# Altium schematic sheet motordriver-v4.0_stspin.SchDoc
size A4; SheetNumber: 3; SheetTotal: 3
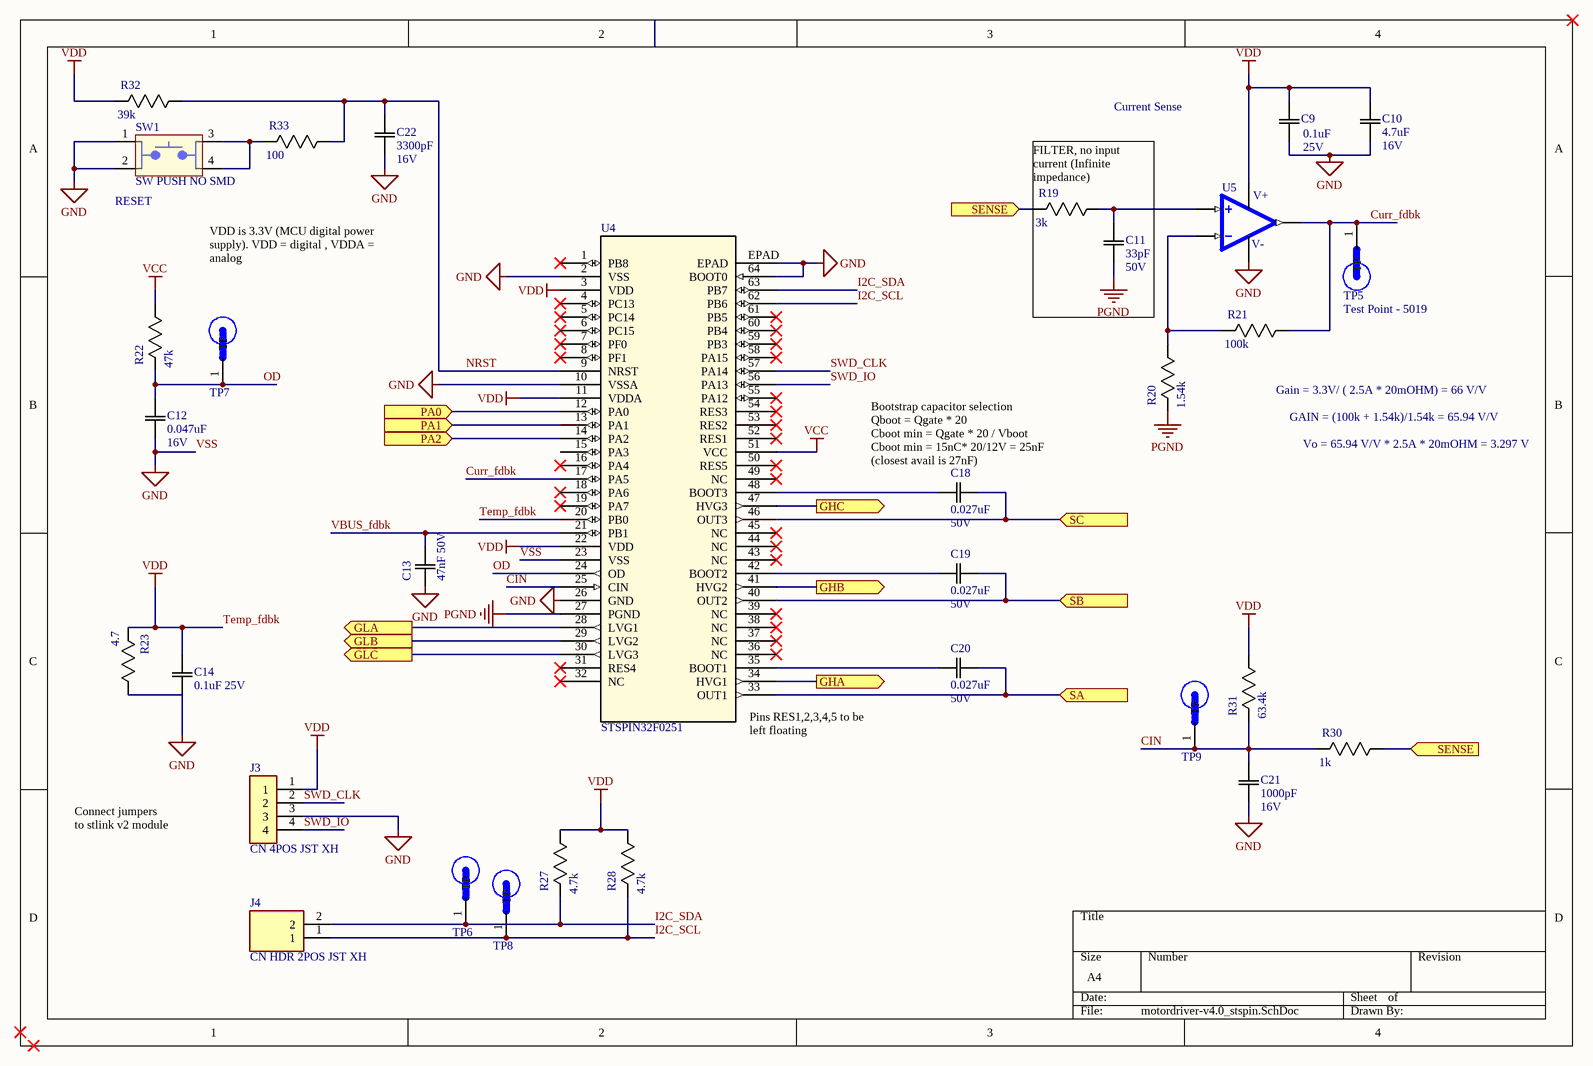
[diagram p0: motordriver-v4.0_stspin.SchDoc]

## Parts
C9  value 0.1uF  Rating: 25V  [0805]  (hidden comment: 0.1uF 25V)
C10  Rating: 16V  [0603]  (hidden comment: 4.7uF)
C11  Rating: 50V  [0603]  (hidden comment: 33pF)
C12  Rating: 16V  [0603]  (hidden comment: 0.047uF)
C13  47nF 50V  [0805]
C14  0.1uF 25V  [0805]
C18  0.027uF  Rating: 50V  [0805]
C19  0.027uF  Rating: 50V  [0805]
C20  0.027uF  Rating: 50V  [0805]
C21  Rating: 16V  [0603]  (hidden comment: 1000pF)
C22  Rating: 16V  [0603]  (hidden comment: 3300pF)
J3  CN 4POS JST XH  [JST_B4B-XH-A(LF)(SN)]
J4  CN HDR 2POS JST XH  [JST_B2B-XH-A(LF)(SN)]
R19  3k  [0603]
R20  1.54k  [0603]
R21  100k  [0603]
R22  47k  [0603]
R23  4.7  [0603]
R27  4.7k  [0603]
R28  4.7k  [0603]
R30  1k  [0603]
R31  63.4k  [0603]
R32  39k  [0603]
R33  100  [0603]
SW1  SW PUSH NO SMD  [TL3305]
TP5  Test Point - 5019  [TP380X203]
TP6  Test Point - 5019  [TP380X203]  (value not drawn)
TP7  Test Point - 5019  [TP380X203]  (value not drawn)
TP8  Test Point - 5019  [TP380X203]  (value not drawn)
TP9  Test Point - 5019  [TP380X203]  (value not drawn)
U4  STSPIN32F0251  [STSPIN32F0251TR]
U5  OP AMP TSV911ILT  [TSV911ILT Opamp]  (value not drawn)

## Ports
GHA (out), GHB (out), GHC (out), GLA (out), GLB (out), GLC (out), PA0 (in), PA1 (in), PA2 (in), SA (in), SB (in), SC (in), SENSE (in)

## Nets
PGND: C11.1(C1) R20.2(R2) U4.27(PGND)
Temp_fdbk: C9.2(C2) C10.2(C2) C14.2(C2) J3.1 R23.2(R2) R27.1(R1) R28.1(R1) R31.1(R1) R32.2(R2) U4.3(VDD) U4.11(VDDA) U4.20(PB0) U4.22(VDD) U5.5(V+)  [also labelled VDD]
VCC: R22.1(R1) U4.51(VCC)
VSS: C9.1(C1) C10.1(C1) C12.1(C1) C13.1(C1) C14.1(C1) C21.2(C2) C22.1(C1) J3.3 R23.1(R1) SW1.1 SW1.2 U4.2(VSS) U4.10(VSSA) U4.23(VSS) U4.26(GND) U4.64(BOOT0) U4.EPAD U5.2(V-)  [also labelled GND]
CIN: C21.1(C1) R30.2(R2) R31.2(R2) TP9.1(TP) U4.25(CIN)
Curr_fdbk: R21.1(R1) TP5.1(TP) U4.17(PA5) U5.1(OUT)
GHA: U4.34(HVG1) ; port GHA
GHB: U4.41(HVG2) ; port GHB
GHC: U4.47(HVG3) ; port GHC
GLA: U4.28(LVG1) ; port GLA
GLB: U4.29(LVG2) ; port GLB
GLC: U4.30(LVG3) ; port GLC
I2C_SCL: J4.1 R28.2(R2) TP8.1(TP) U4.62(PB6)
I2C_SDA: J4.2 R27.2(R2) TP6.1(TP) U4.63(PB7)
NRST: C22.2(C2) R32.1(R1) R33.1(R1) U4.9(NRST)
OD: C12.2(C2) R22.2(R2) TP7.1(TP) U4.24(OD)
PA0: U4.12(PA0) ; port PA0
PA1: U4.13(PA1) ; port PA1
PA2: U4.14(PA2) ; port PA2
SA: C20.2 U4.33(OUT1) ; port SA
SB: C19.2 U4.40(OUT2) ; port SB
SC: C18.2 U4.46(OUT3) ; port SC
SENSE: R19.2(R2) R30.1(R1) ; port SENSE
SWD_CLK: J3.2 U4.57(PA14)
SWD_IO: J3.4 U4.56(PA13)
VBUS_fdbk: C13.2(C2) U4.21(PB1)
NetC11_2: C11.2(C2) R19.1(R1) U5.3(IN+)
NetC18_1: C18.1 U4.48(BOOT3)
NetC19_1: C19.1 U4.42(BOOT2)
NetC20_1: C20.1 U4.35(BOOT1)
NetR20_1: R20.1(R1) R21.2(R2) U5.4(IN-)
NetR33_2: R33.2(R2) SW1.3 SW1.4

Not connected (* = marked no-connect by the designer): U4 1(PB8)* 4(PC13)* 5(PC14)* 6(PC15)* 7(PF0)* 8(PF1)* 15(PA3) 16(PA4)* 18(PA6)* 19(PA7)* 31(RES4)* 32(NC)* 36(NC)* 37(NC)* 38(NC)* 39(NC)* 43(NC)* 44(NC)* 45(NC)* 49(NC)* 50(RES5)* 52(RES1)* 53(RES2)* 54(RES3)* 55(PA12)* 58(PA15)* 59(PB3)* 60(PB4)* 61(PB5)*

## Notes on the sheet
- Current Sense
- (near SW1) RESET
- VDD is 3.3V (MCU digital power supply). VDD = digital , VDDA = analog
- FILTER, no input current (Infinite impedance)
- Gain = 3.3V/ ( 2.5A * 20mOHM) = 66 V/V
- (near C18) Bootstrap capacitor selection
  Qboot = Qgate * 20
  Cboot min = Qgate * 20 / Vboot
  Cboot min = 15nC* 20/12V = 25nF (closest avail is 27nF)
- GAIN = (100k + 1.54k)/1.54k = 65.94 V/V
- Vo = 65.94 V/V * 2.5A * 20mOHM = 3.297 V
- (near U4) Pins RES1,2,3,4,5 to be left floating
- Connect jumpers to stlink v2 module

## Library data of the parts
C9 C14 = CAP 0.1uF 25V: CAP CER 0.1UF 25V X7R 0805; Tolerance: 10%; Temperature Coefficient: X7R; Operating Temperature: -55°C ~ 125°C
  C14: Value: 0.1uF; Rating: 25V
C10 = CAP 4.7uF 16V: CAP CER 4.7UF 16V X5R 0603/0805; Tolerance: 10%; Package: 0603/0805; Temperature Coefficient: X5R; Operating Temperature: -55°C ~ 85°C; Value: 4.7uF
C11 = CAP 33pF 50V: CAP CER 33PF 50V X7R 0603/0805; Tolerance: 10%; Package: 0603/0805; Temperature Coefficient: X7R; Operating Temperature: -55°C ~ 125°C; Value: 33pF
C12 = CAP 0.047uF 16V: CAP CER 0.047UF 16V X5R 0603/0805; Tolerance: 10%; Package: 0603/0805; Temperature Coefficient: X5R; Operating Temperature: -55°C ~ 85°C; Value: 0.047uF
C13 = CAP 47nF 50V: CAP CER 0.047UF 50V X7R 0805; Tolerance: 5%; Package: 0805; Value: 47nF; Rating: 50V; Alt. Value: 47nF
C18-C20 = CAP 0.027UF 50V X7R 0805: CAP CER 0.027UF 50V X7R 0805; Tolerance: 5%; Package: 0805; Temperature Coefficient: X7R; Operating Temperature: -55°C ~ 125°C; Value: 0.027uF
C21 = CAP 1000pF 16V: CAP CER 1000PF 16V X5R 0603/0805; Tolerance: 10%; Package: 0603/0805; Temperature Coefficient: X5R; Operating Temperature: -55°C ~ 85°C; Value: 1000pF
C22 = CAP 3300pF 16V: CAP CER 3300PF 16V X5R 0603/0805; Tolerance: 10%; Package: 0603/0805; Temperature Coefficient: X5R; Operating Temperature: -55°C ~ 85°C; Value: 3300pF
J3 = CN 4POS JST XH: Connector Header Through Hole 4 position 0.098 _2.50mm_ / B4B-XH-A(LF)(SN); MP: B4B-XH-A_LF__SN_; MF: JST Sales; Price: None; Package: None; Value: *; Availability: Unavailable; SnapEDA_Link: https://www.snapeda.com/parts/B4B-XH-A%28LF%29%28SN%29/JST%20Sales%20America%20Inc./view-part/447494/?ref=snap
J4 = CN HDR 2POS JST XH: Connector Header Through Hole 2 position 0.098 _2.50mm_ / JST XH; MP: B2B-XH-A_LF__SN_; MF: JST Sales; Price: None; Package: None; Value: *; Availability: Unavailable; SnapEDA_Link: https://www.snapeda.com/parts/B2B-XH-A%28LF%29%28SN%29/JST%20Sales%20America%20Inc./view-part/492310/?ref=snap
R19 = RES 3k 1/8W: RES SMD 3K OHM 5% 1/8W 0805; Power (Watts): 0.125W; Package: 0805; Value: 3k; Tolerance: 5%
R20 = RES 1.54k 1/8W: RES SMD 1.54K OHM 1% 1/8W 0805; Power (Watts): 0.125W; Package: 0805; Value: 1.54k; Tolerance: 1%
R21 = RES 100k 1/8W - 1%: RES SMD 100K OHM 1% 1/8W 0805; Power (Watts): 0.125W; Package: 0805; Value: 100k; Tolerance: 1%
R22 = RES 47k 1/8W - 5%: RES SMD 47k OHM 5% 1/8W 0805; Power (Watts): 0.125W; Package: 0805; Value: 47k; Tolerance: 5%
R23 = RES 4.7 1/8W: RES SMD 4.7 OHM 5% 1/8W 0805; Power (Watts): 0.125W; Package: 0805; Value: 4.7; Tolerance: 5%
R27 R28 = RES 4.7k 1/8W - 1%: RES SMD 4.7k OHM 1% 1/8W 0805; Power (Watts): 0.125W; Package: 0805; Value: 4.7k; Tolerance: 1%
R30 = RES 1k 1/8W: RES SMD 1K OHM 5% 1/8W 0805; Power (Watts): 0.125W; Package: 0805; Value: 1k; Tolerance: 5%
R31 = RES 63.4k 1/8W: RES SMD 63.4K OHM 5% 1/8W 0603/0805; Power (Watts): 0.125W; Package: 0805; Value: 63.4k; Tolerance: 5%
R32 = RES 39k 1/8W: RES SMD 39K OHM 5% 1/8W 0603/0805; Power (Watts): 0.125W; Package: 0805; Value: 39k; Tolerance: 5%
R33 = RES 100.0 1/8W: RES SMD 100 OHM 5% 1/8W 0603/0805; Power (Watts): 0.125W; Package: 0805; Value: 100; Tolerance: 5%
SW1 = SW PUSH NO SMD: Tactile Switch SPST-NO Top Actuated Surface Mount 12V 50mA; MF: E-Switch; MP: TL3305BF260QG; Switch Function: Off-Mom; Actuator Height: 5mm; Digikey: EG5354DKR-ND; ComponentLink1Description: Digikey; ComponentLink1URL: https://www.digikey.ca/en/products/detail/e-switch/TL3305BF260QG/5816185; ComponentLink2Description: Datasheet; ComponentLink2URL: https://sten-eswitch-13110800-production.s3.amazonaws.com/system/asset/product_line/data_sheet/213/TL3305.pdf; Circuit: SPST-NO; Mounting Type: SMD
TP5-TP9 = Test Point - 5019: PC Test Point, Miniature Phosphor Bronze, Silver Plating Surface Mount Mounting Type; MP: 5019; MF: Keystone Electronics; Value: *; Package: 2010 Keystone; Digi-Key_Part_Number: 36-5019CT-ND; Digi-Key_Purchase_URL: https://www.digikey.com/product-detail/en/keystone-electronics/5019/36-5019CT-ND/3907344?utm_source=snapeda&utm_medium=aggregator&utm_campaign=symbol
U4 = STSPIN32F0251: 250 V BLDC THREE-PHASE CONTROLLER; Manufacturer: STMicroelectronics; V rating: 9V ~ 20V; Digikey Link: https://www.digikey.ca/en/products/detail/stmicroelectronics/STSPIN32F0251TR/11591126; Digikey PN: 497-STSPIN32F0251CT-ND; Manufacturer PN: STSPIN32F0251TR; Package: 64-TQFP Exposed Pad
U5 = OP AMP TSV911ILT: IC OPAMP GP 1 CIRCUIT SOT23-5; Manufacturer: STMicroelectronics; DK PN: 497-6000-1-ND; Vsupply: 2.5V ~ 5.5V; DK Link: https://www.digikey.ca/en/products/detail/stmicroelectronics/TSV911ILT/1578404; Manu PN: TSV911ILT